# EAGLE design eCog106_BLED (EAGLE 6.6.0)
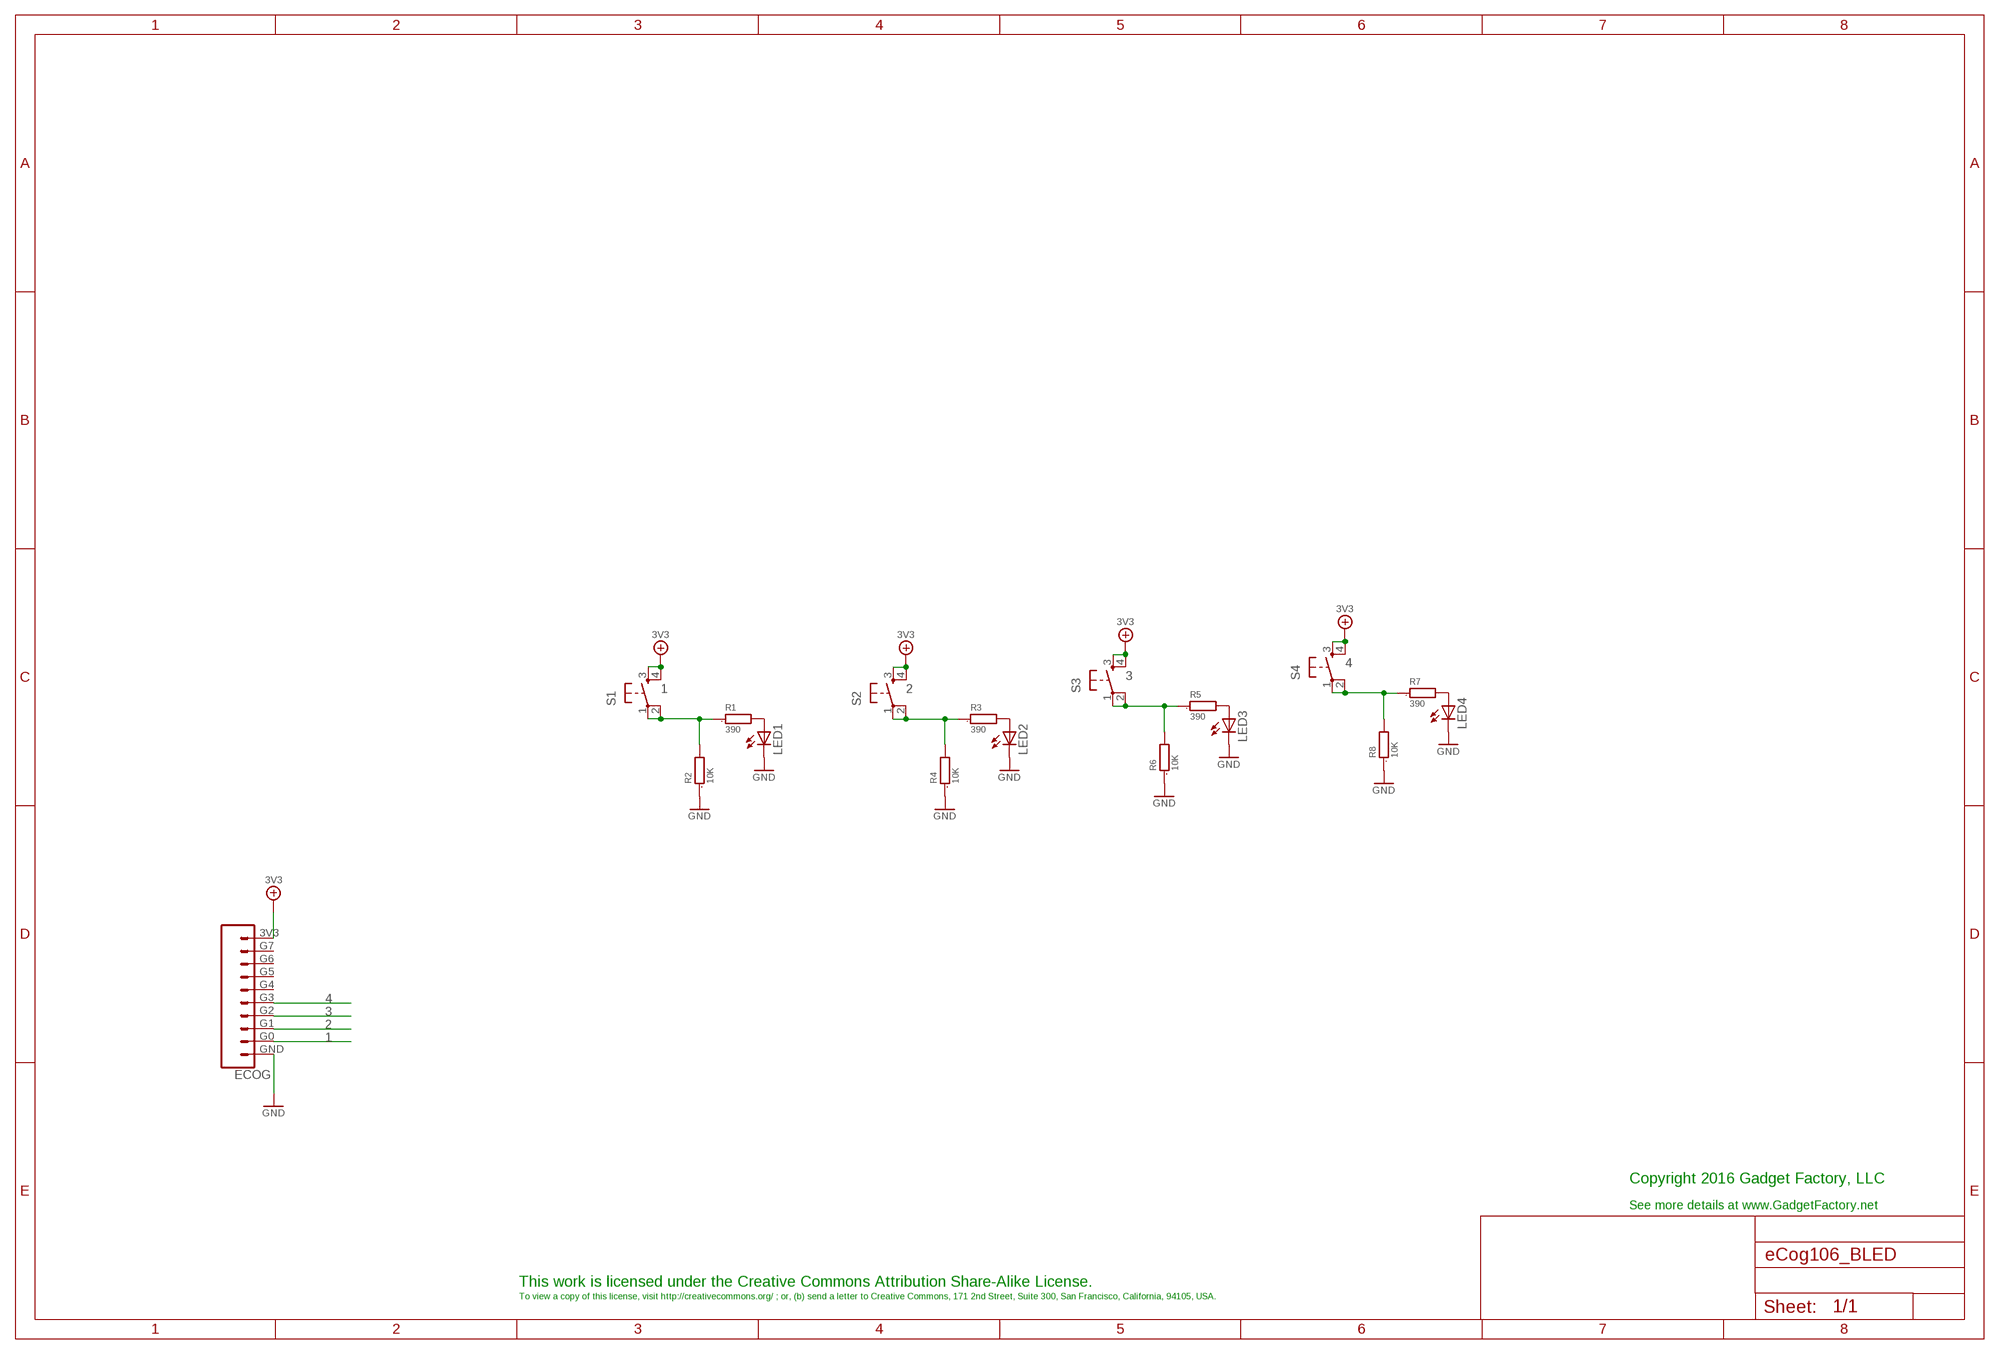
[diagram p0: schematic, sheet 1]

## Parts
ECOG  ECOG_GENERAL_ROWECOG_GENERAL_SMD  [ECOG_GENERAL_SMD]
LED1  LEDCHIP-LED0805  [CHIP-LED0805]
LED2  LEDCHIP-LED0805  [CHIP-LED0805]
LED3  LEDCHIP-LED0805  [CHIP-LED0805]
LED4  LEDCHIP-LED0805  [CHIP-LED0805]
R1  390  R0805  [0805]
R2  10K  R0805  [0805]
R3  390  R0805  [0805]
R4  10K  R0805  [0805]
R5  390  R0805  [0805]
R6  10K  R0805  [0805]
R7  390  R0805  [0805]
R8  10K  R0805  [0805]
S1  TAC_SWITCHPTH  [TACTILE-PTH]
S2  TAC_SWITCHPTH  [TACTILE-PTH]
S3  TAC_SWITCHPTH  [TACTILE-PTH]
S4  TAC_SWITCHPTH  [TACTILE-PTH]

## Nets
1: ECOG.G0 R1.1 R2.2 S1.1 S1.2
2: ECOG.G1 R3.1 R4.2 S2.1 S2.2
3: ECOG.G2 R5.1 R6.2 S3.1 S3.2
3V3: ECOG.3V3 S1.3 S1.4 S2.3 S2.4 S3.3 S3.4 S4.3 S4.4
4: ECOG.G3 R7.1 R8.2 S4.1 S4.2
GND: ECOG.GND LED1.C LED2.C LED3.C LED4.C R2.1 R4.1 R6.1 R8.1
N$1: LED1.A R1.2
N$2: LED2.A R3.2
N$3: LED3.A R5.2
N$4: LED4.A R7.2
Unconnected: ECOG.G4 ECOG.G5 ECOG.G6 ECOG.G7

## Notes on the sheet
- Copyright 2016 Gadget Factory, LLC
- See more details at www.GadgetFactory.net
- This work is licensed under the Creative Commons Attribution Share-Alike License.
- To view a copy of this license, visit http://creativecommons.org/ ; or, (b) send a letter to Creative Commons, 171 2nd Street, Suite 300, San Francisco, California, 94105, USA.

## Library data of the parts
ECOG = eCogs:ECOG_GENERAL_ROW; DIGIKEY: S1013EC-10-ND
LED1-LED4 = adafruit:LED: LED OSRAM: - CHIPLED LG R971, LG N971, LY N971, LG Q971, LY Q971, LO R971, LY R971 LH N974, LH R974 LS Q976, LO Q976, LY Q976 LO Q996 - Hyper CHIPLED LW Q18S LB Q993, LB Q99A, LB R99A - SideLED LS A670, LO A670, LY A670, LG A670, LP A670 LB A673, LV A673, LT A673, LW A673 LH A674 LY A675 LS A676, LA A676, LO A676, LY A676, LW A676 LS A679, LY A679, LG A679 - Hyper Micro SIDELED® LS Y876, LA Y876, LO Y876, LY Y876 LT Y87S - SmartLED LW L88C, LW L88S LB L89C, LB L89S, LG L890 LS L89K, LO L89K, LY L89K LS L896, LA L896, LO L896, LY L896 - TOPLED LS T670, LO T670, LY T670, LG T670, LP T670 LSG T670, LSP T670, LSY T670, LOP T670, LYG T670 LG T671, LOG T671, LSG T671 LB T673, LV T673, LT T673, LW T673 LH T674 LS T676, LA T676, LO T676, LY T676, LB T676, LH T676, LSB T676, LW T676 LB T67C, LV T67C, LT T67C, LS T67K, LO T67K, LY T67K, LW E67C LS E67B, LA E67B, LO E67B, LY E67B, LB E67C, LV E67C, LT E67C LW T67C LS T679, LY T679, LG T679 LS T770, LO T770, LY T770, LG T770, LP T770 LB T773, LV T773, LT T773, LW T773 LH T774 LS E675, LA E675, LY E675, LS T675 LS T776, LA T776, LO T776, LY T776, LB T776 LHGB T686 LT T68C, LB T68C - Hyper Mini TOPLED® LB M676 - Mini TOPLED Santana® LG M470 LS M47K, LO M47K, LY M47K Source: http://www.osram.convergy.de/; DIGIKEY: 475-1410-2-ND
R1 R3 R5 R7 = GadgetFactory:R: RESISTOR, European symbol; DIGIKEY: RMCF0805JT390RCT-ND
R2 R4 R6 R8 = GadgetFactory:R: RESISTOR, European symbol; DIGIKEY: RMCF0805JT10K0CT-ND
S1-S4 = SparkFun:TAC_SWITCH: Momentary Switch Button commonly used for reset or general input. Spark Fun Electronics SKU : COM-00097; DIGIKEY: 679-2428-ND

## Board
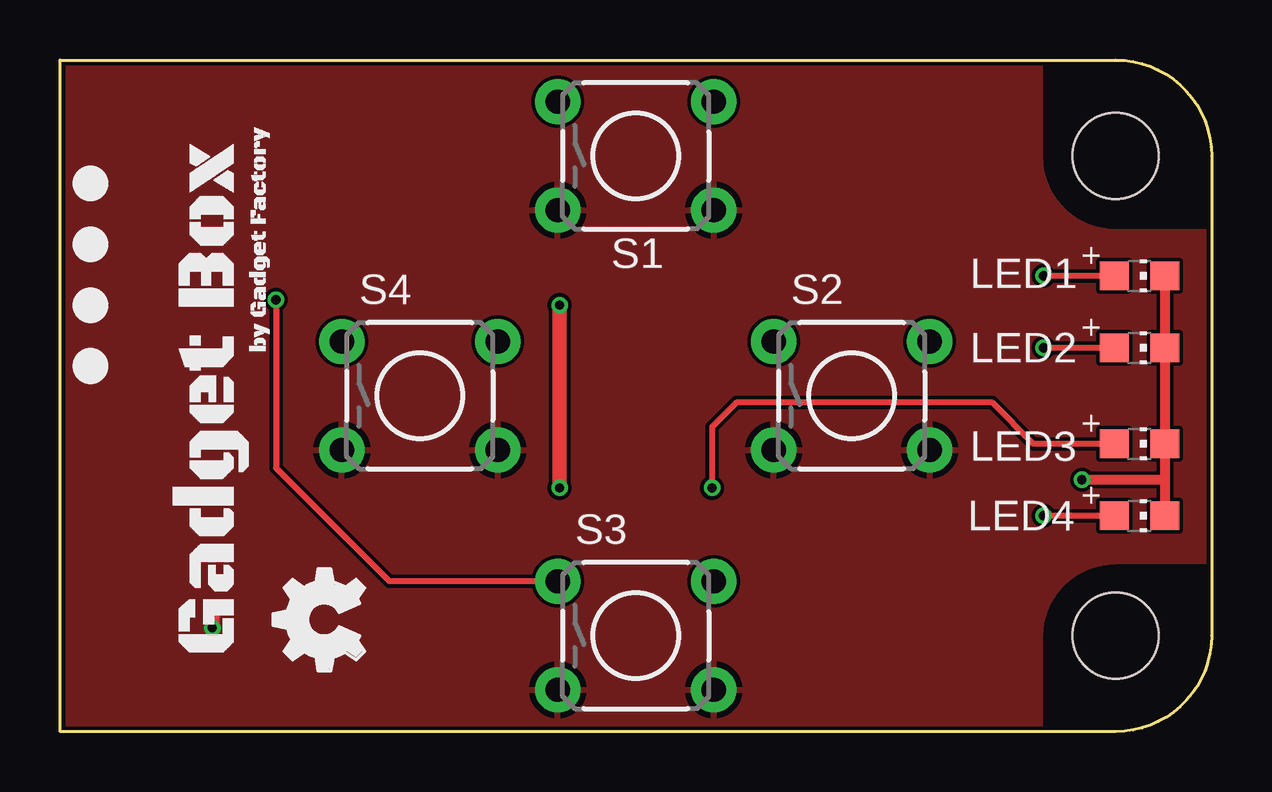
[diagram p1: board, top side]
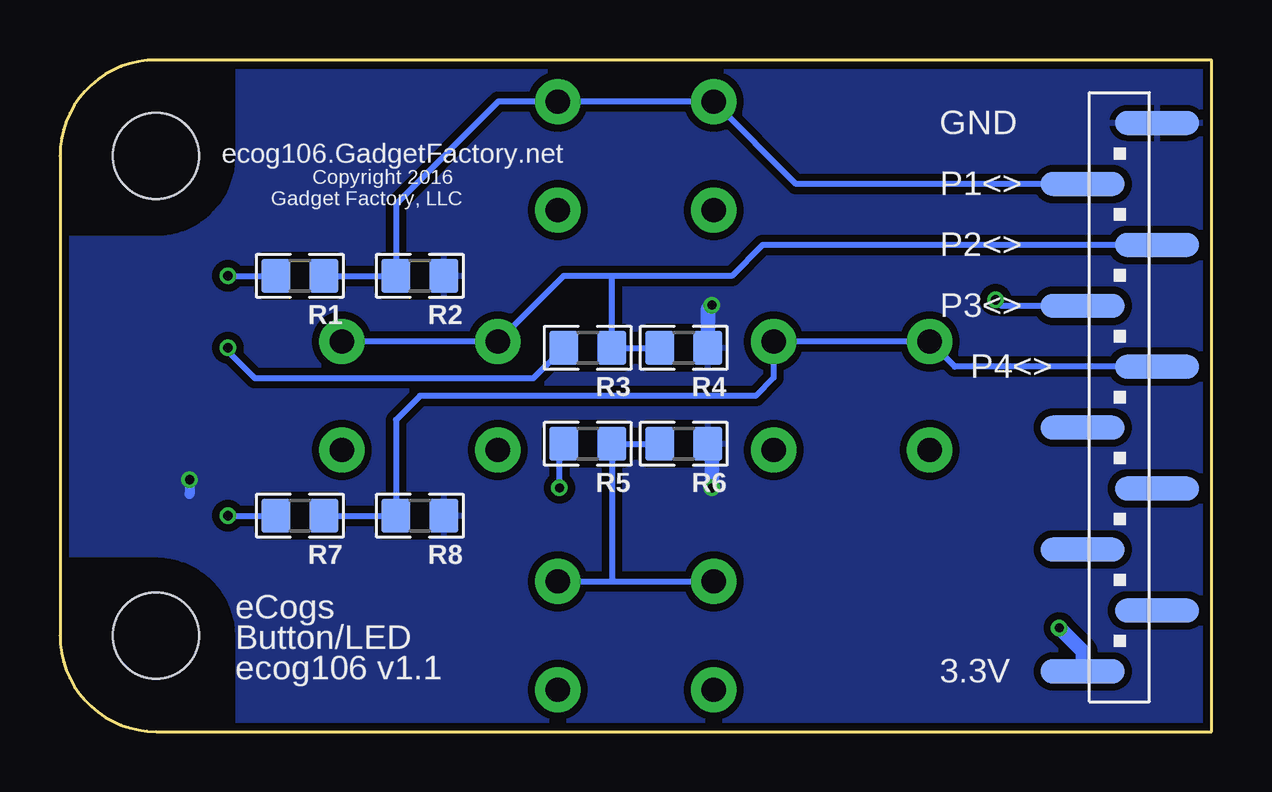
[diagram p2: board, bottom side, seen from below]

Size 48 x 28 mm. Coordinates in mm from the lower left corner, seen from the top.
Copper layers (1*16): Top 0.035mm / dielectric 1.5mm / Bottom 0.035mm
Design rules "hackvana *": minimum track width 6mil, minimum drill 0.3mm, track to track 6mil, track to pad 6mil, pad to pad 6mil, via to via 6mil, smd to smd 0mil, copper to edge 6mil, drill to drill 6mil, minimum pad ring 10mil, minimum via ring 6mil, stop-mask expansion 2mil, vias tented up to drill 100mil, thermal gap 10mil

### Footprints (pad centres in the part's own frame; a part is rotated, then mirrored left to right if it is on the bottom)
ECOG_GENERAL_SMD = smd 3.5 x 1 bottom: 3V3 5.369,2.51; G0 5.369,22.83; G1 2.271,20.29; G2 5.369,17.75; G3 2.271,15.21; G4 5.369,12.67; G5 2.271,10.13; G6 5.369,7.59; G7 2.271,5.05; GND 2.271,25.37 | hole 3.6: 44,4; 44,24
CHIP-LED0805 = smd 1.2 x 1.2: A 0,-1.05; C 0,1.05
0805 = smd 1.2 x 1.4: 1 -1,0; 2 1,0
TACTILE-PTH = drill 1.016 pad 1.88: 1 -3.251,2.261; 2 3.251,2.261; 3 -3.251,-2.261; 4 3.251,-2.261

### Placement (x,y rotation side)
ECOG  0,0 0 top
LED1  45,19 270 top
LED2  45,16 270 top
LED3  45,12 270 top
LED4  45,9 270 top
R1  38,19 180 bottom
R2  33,19 180 bottom
R3  26,16 180 bottom
R4  22,16 180 bottom
R5  26,12 180 bottom
R6  22,12 180 bottom
R7  38,9 180 bottom
R8  33,9 180 bottom
S1  24,24 0 top
S2  33,14 0 top
S3  24,4 0 top
S4  15,14 0 top
U$1  [LEGEND_DIO]  1.27,22.86 0 top
U$2  [LEGEND_DIO]  1.27,20.32 0 top
U$3  [LEGEND_DIO]  1.27,17.78 0 top
U$4  [LEGEND_DIO]  1.27,15.24 0 top
U$5  [GADGETBOX_SMALL]  6.35,13.97 90 top
U$6  [OSHW_FILLX150_NOTEXT]  12.7,2.54 90 top

### Tracks (layer width: path | path; a pad name or v marks a point on that pad's centre or on a via)
1
  Bottom 0.254: R1.1 R2.2 34,22 29.74,26.26 S1.2 S1.1 17.32,22.83 ECOG.G0
2
  Bottom 0.254: R4.2 R3.1 25,19 | ECOG.G1 18.71,20.29 20,19 25,19 | 25,19 27.01,19 S2.1 S2.2
3  (via drill 0.38)
  Top 0.254: v9,18 9,11 13.74,6.26 S3.1
  Bottom 0.254: R6.2 R5.1 25,6.26 | S3.2 25,6.26 | 25,6.26 S3.1 | ECOG.G2 8.75,17.75 v9,18
3V3  (via drill 0.38)
  Top 0.61: v6.35,4.32 6.35,4.83
  Bottom 0.61: ECOG.3V3 5.37,3.34 v6.35,4.32
  pour Top: -1,29 49,29 49,-1 -1,-1
4
  Bottom 0.254: R7.1 R8.2 34,13 33,14 19,14 18.25,14.75 S4.2 S4.1 10.7,15.21 ECOG.G3
GND  (via drill 0.38)
  Top 0.406: LED1.C LED2.C LED3.C 46.05,10.48 | 46.05,10.48 LED4.C | 46.05,10.48 42.62,10.48 v42.6,10.5
  Top 0.61: v20.83,17.78 v20.83,10.16
  Bottom 0.406: v42.6,10.5 42.6,9.9
  Bottom 0.61: R4.1 21,17.61 v20.83,17.78 | v20.83,10.16 20.83,11.83 R6.1
  pour Bottom (isolate 0.305): -2,30 50,30 50,-2 -2,-2
N$1  (via drill 0.38)
  Top 0.254: LED1.A v41,19
  Bottom 0.254: v41,19 R1.2
N$2  (via drill 0.38)
  Top 0.254: LED2.A v41,16
  Bottom 0.254: v41,16 41,15.85 39.88,14.73 28.27,14.73 R3.2
N$3  (via drill 0.38)
  Top 0.254: LED3.A 40.58,12 38.86,13.72 28.19,13.72 27.18,12.7 v27.18,10.16
  Bottom 0.254: v27.18,10.16 27.18,11.82 R5.2
N$4  (via drill 0.38)
  Top 0.254: LED4.A v41,9
  Bottom 0.254: v41,9 R7.2

### Text on the board
bPlace: GND | ecog106.GadgetFactory.net | Copyright 2016 | P1<> | Gadget Factory, LLC | P2<> | P3<> | P4<> | eCogs | Button/LED | 3.3V | ecog106 v1.1